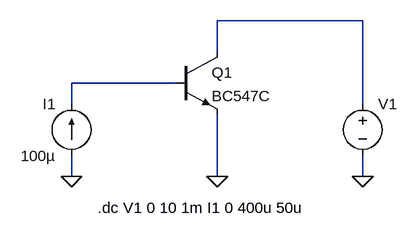
[diagram p0: schematic transistor-curva-salida.asc]
transistor-curva-salida.asc, the LTspice schematic file:
Version 4
SHEET 1 880 680
WIRE 512 16 288 16
WIRE 288 64 288 16
WIRE 224 112 64 112
WIRE 64 144 64 112
WIRE 512 144 512 16
WIRE 64 256 64 224
WIRE 288 256 288 160
WIRE 512 256 512 224
FLAG 64 256 0
FLAG 288 256 0
FLAG 512 256 0
SYMBOL npn 224 64 R0
SYMATTR InstName Q1
SYMATTR Value BC547C
SYMBOL voltage 512 128 R0
WINDOW 3 24 44 Left 2
WINDOW 123 0 0 Left 0
WINDOW 39 0 0 Left 0
SYMATTR Value ""
SYMATTR InstName V1
SYMBOL current 64 224 R180
WINDOW 0 24 80 Left 2
WINDOW 3 24 0 Left 2
WINDOW 123 0 0 Left 0
WINDOW 39 0 0 Left 0
SYMATTR InstName I1
SYMATTR Value 100µ
TEXT 104 304 Left 2 !.dc V1 0 10 1m I1 0 400u 50u

The netlist it stands for:
* transistor-curva-salida.asc
Q1 N001 N002 0 0 BC547C
V1 N001 0
I1 0 N002 100µ
.model NPN NPN
.model PNP PNP
.lib standard.bjt
.dc V1 0 10 1m I1 0 400u 50u
.backanno
.end